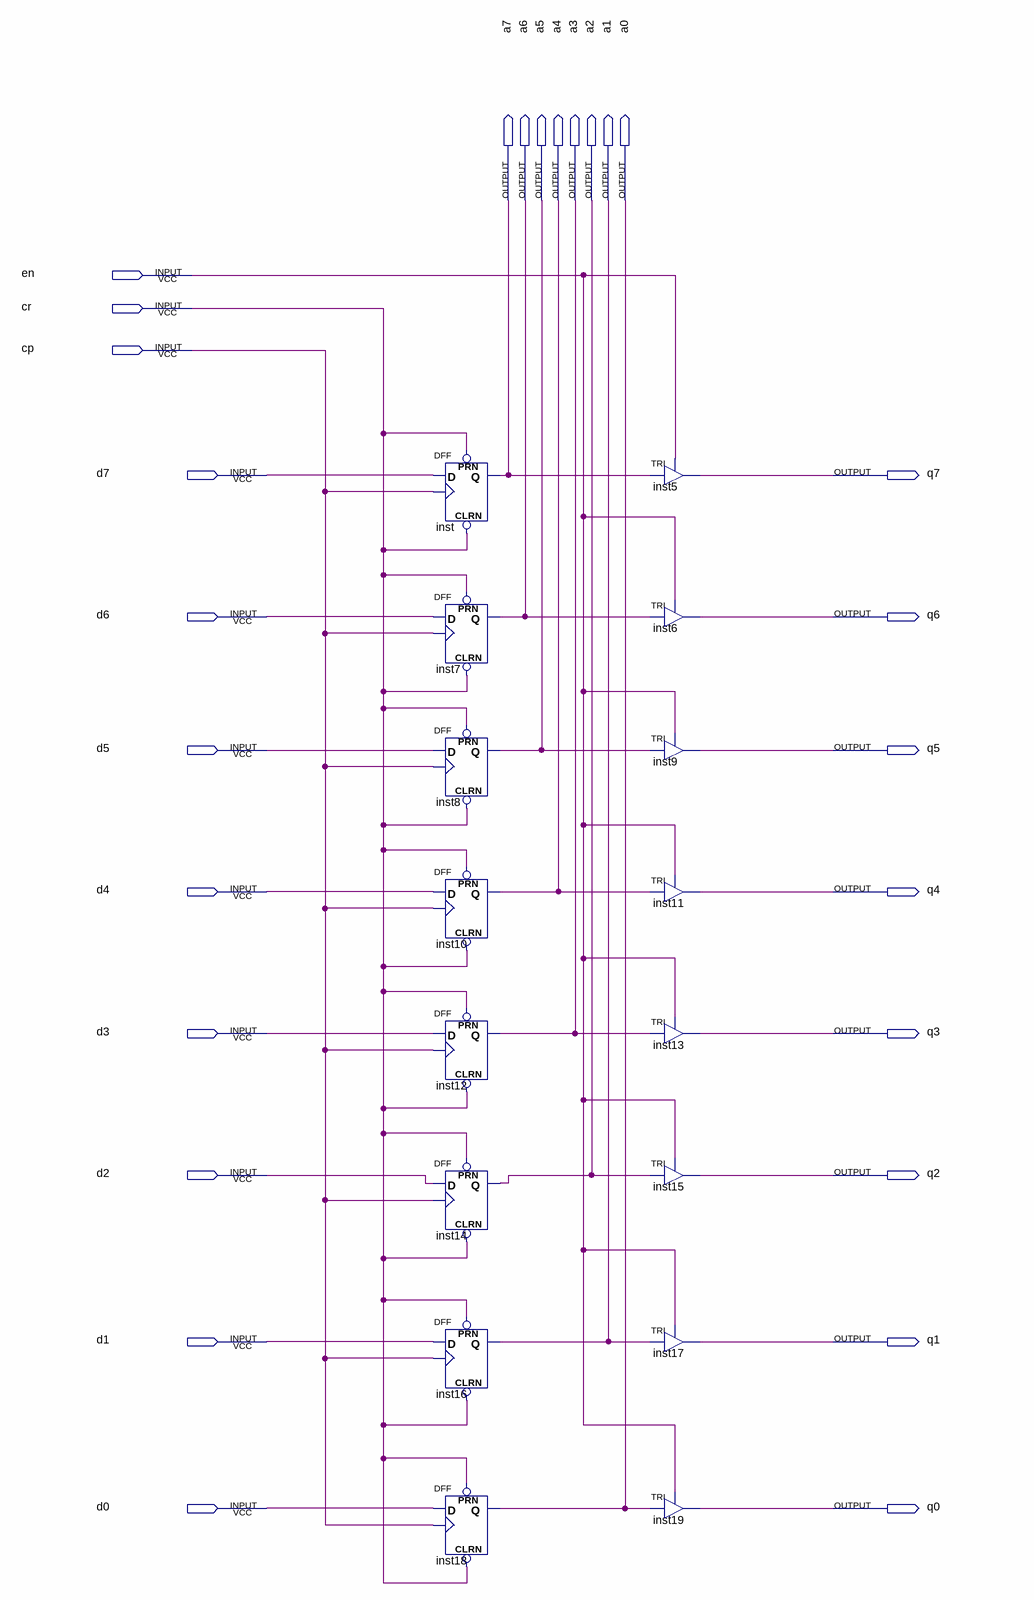
[diagram p0: schematic sheet]
// Quartus schematic MBR_new.bdf as structural Verilog: 16 symbols, 27 pins
module MBR_new (
  input  en,
  input  cr,
  input  cp,
  input  d7,
  input  d6,
  input  d5,
  input  d4,
  input  d3,
  input  d2,
  input  d1,
  input  d0,
  output a7,
  output a6,
  output a5,
  output a4,
  output a3,
  output a2,
  output a1,
  output a0,
  output q7,
  output q6,
  output q5,
  output q4,
  output q3,
  output q2,
  output q1,
  output q0
);

  DFF inst (.CLRN(cr), .CLK(cp), .D(d7), .PRN(cr), .Q(a7));
  DFF inst7 (.CLRN(cr), .CLK(cp), .D(d6), .PRN(cr), .Q(a6));
  DFF inst8 (.CLRN(cr), .CLK(cp), .D(d5), .PRN(cr), .Q(a5));
  DFF inst10 (.CLRN(cr), .CLK(cp), .D(d4), .PRN(cr), .Q(a4));
  DFF inst12 (.CLRN(cr), .CLK(cp), .D(d3), .PRN(cr), .Q(a3));
  DFF inst14 (.CLRN(cr), .CLK(cp), .D(d2), .PRN(cr), .Q(a2));
  DFF inst16 (.CLRN(cr), .CLK(cp), .D(d1), .PRN(cr), .Q(a1));
  DFF inst18 (.CLRN(cr), .CLK(cp), .D(d0), .PRN(cr), .Q(a0));
  TRI inst5 (.IN(a7), .OE(en), .OUT(q7));
  TRI inst6 (.IN(a6), .OE(en), .OUT(q6));
  TRI inst9 (.IN(a5), .OE(en), .OUT(q5));
  TRI inst11 (.IN(a4), .OE(en), .OUT(q4));
  TRI inst13 (.IN(a3), .OE(en), .OUT(q3));
  TRI inst15 (.IN(a2), .OE(en), .OUT(q2));
  TRI inst17 (.IN(a1), .OE(en), .OUT(q1));
  TRI inst19 (.IN(a0), .OE(en), .OUT(q0));
endmodule
